# Altium project PCB_Project_invertor.PrjPcb
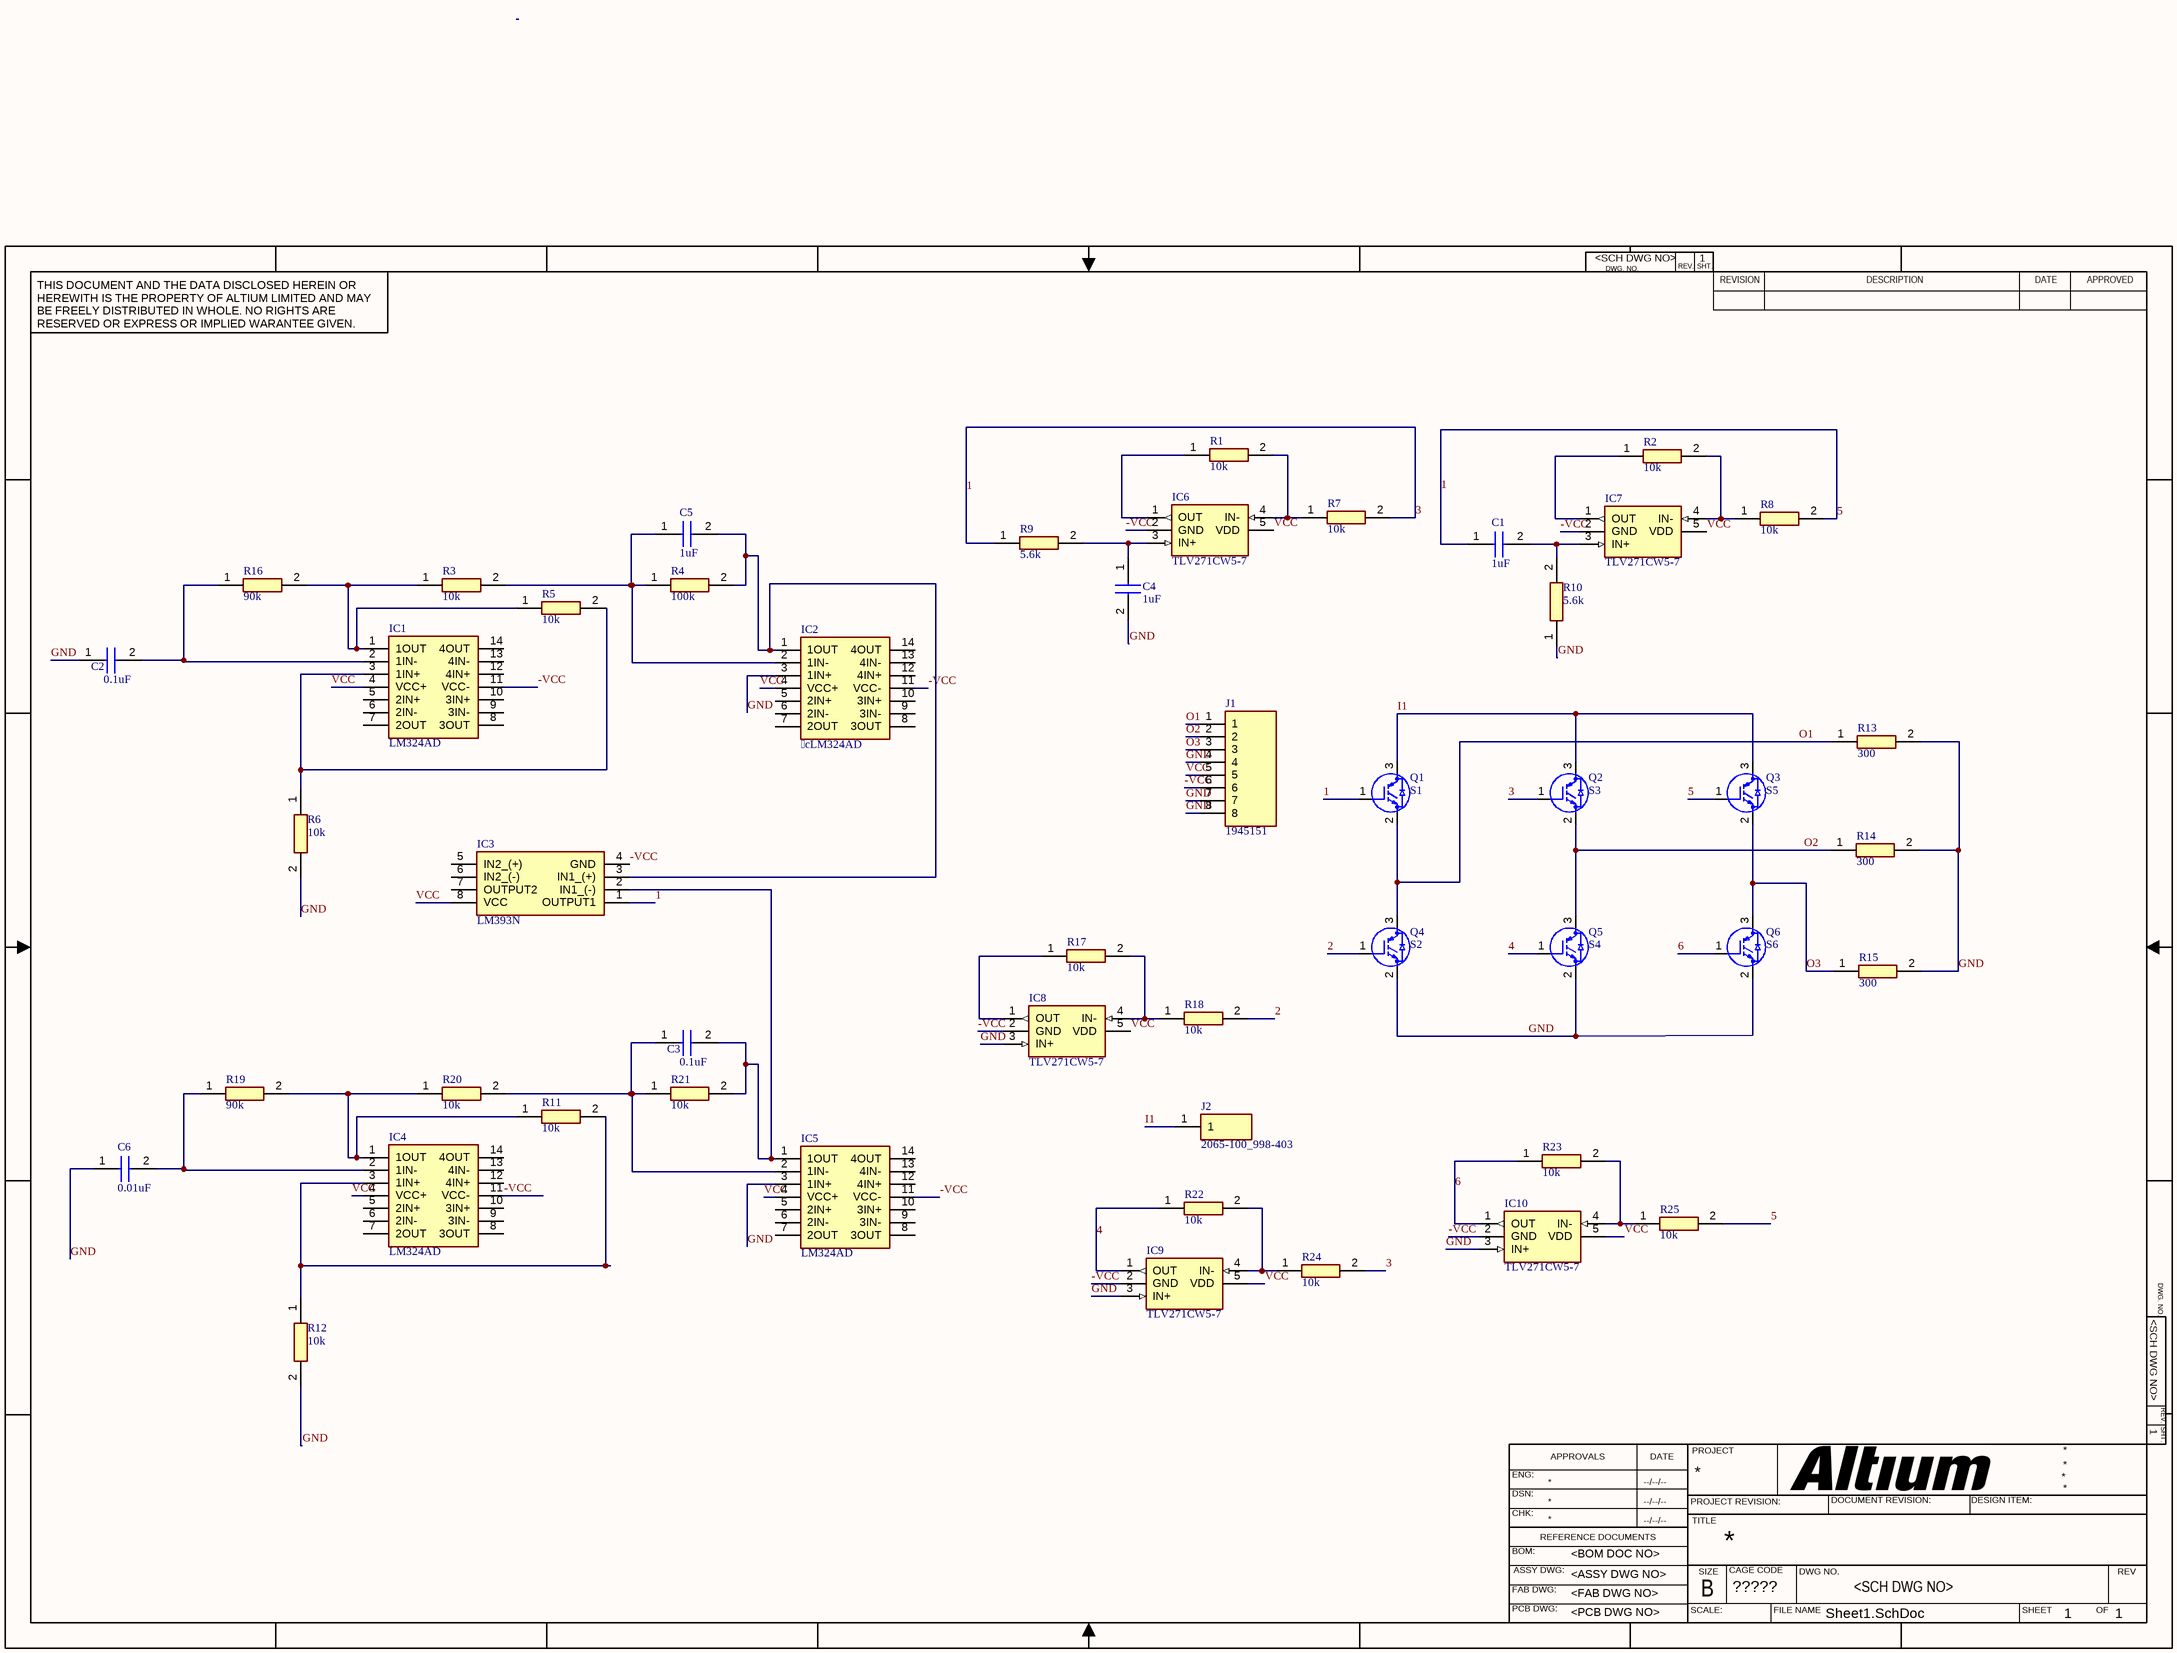
[diagram p0: Sheet1.SchDoc]
CAGE_CODE: ?????; CONTRACT_NUMBER: <CONTRACT NO>; DOC_NO_ASSY_DWG: <ASSY DWG NO>; DOC_NO_BOM: <BOM DOC NO>; DOC_NO_FAB_DWG: <FAB DWG NO>; DOC_NO_SCH_DWG: <SCH DWG NO>; PCB_2_DEC_TOL: +/-.01; PCB_3_DEC_TOL: +/-.010; PCB_ANG_TOL: +/-1/2; PCB_ASSEMBLY_NO: <PCB ASSY NO>; PCB_CHECKER: - -----; PCB_CHECKER_APP_DATE: --/--/----; PCB_DESIGNER: - -----; PCB_DESIGNER_APP_DATE: --/--/----; PCB_DWG_NO: <PCB DWG NO>; PCB_ENGINEER: - -----; PCB_ENGINEER_APP_DATE: --/--/----; PCB_PART_NUMBER: <PCB PN>; PCB_REV: A; SCH_REV: A
1 sheet, 49 parts. Net scope: global (net labels, ports and power ports of the same name join across sheets).
Board file: PCB1.PcbDoc

## Sheet Sheet1.SchDoc
size 431 x 279 mm; SheetNumber: 1; SheetTotal: 1; ENG_APP_DATE: --/--/--; DSN_APP_DATE: --/--/--; CHK_APP_DATE: --/--/--

### Parts
C1  1uF  [CAPC1005X55N]
C2  0.1uF  [CAPC1005X55N]
C3  0.1uF  [CAPC1005X55N]
C4  1uF  [CAPC1005X55N]
C5  1uF  [CAPC1005X55N]
C6  0.01uF  [C0603]
IC1  LM324AD  [SOIC127P600X175-14N]
IC2  cLM324AD  [SOIC127P600X175-14N]
IC3  LM393N  [DIP762W53P254L980H533Q8N]
IC4  LM324AD  [SOIC127P600X175-14N]
IC5  LM324AD  [SOIC127P600X175-14N]
IC6  TLV271CW5-7  [SOT95P285X130-5N]
IC7  TLV271CW5-7  [SOT95P285X130-5N]
IC8  TLV271CW5-7  [SOT95P285X130-5N]
IC9  TLV271CW5-7  [SOT95P285X130-5N]
IC10  TLV271CW5-7  [SOT95P285X130-5N]
J1  1945151  [1945151]
J2  2065-100_998-403  [2065100998403]
Q1  S1  [TO544P521X1592X2557-3P]
Q2  S3  [TO544P521X1592X2557-3P]
Q3  S5  [TO544P521X1592X2557-3P]
Q4  S2  [TO544P521X1592X2557-3P]
Q5  S4  [TO544P521X1592X2557-3P]
Q6  S6  [TO544P521X1592X2557-3P]
R1  10k  [RESC2012X60N]
R2  10k  [RESC2012X60N]
R3  10k  [RESC2012X60N]
R4  100k  [RESC2012X60N]
R5  10k  [RESC2012X60N]
R6  10k  [RESC2012X60N]
R7  10k  [RESC2012X60N]
R8  10k  [RESC2012X60N]
R9  5.6k  [RESC1005X40N]
R10  5.6k  [RESC1005X40N]
R11  10k  [RESC2012X60N]
R12  10k  [RESC2012X60N]
R13  300  [RESC1632X65N]
R14  300  [RESC1632X65N]
R15  300  [RESC1632X65N]
R16  90k  [RESC3116X65N]
R17  10k  [RESC2012X60N]
R18  10k  [RESC2012X60N]
R19  90k  [RESC3116X65N]
R20  10k  [RESC2012X60N]
R21  10k  [RESC2012X60N]
R22  10k  [RESC2012X60N]
R23  10k  [RESC2012X60N]
R24  10k  [RESC2012X60N]
R25  10k  [RESC2012X60N]

### Nets
1: C1.1 IC3.1(OUTPUT1) Q1.1(G) Q2.1(G) Q3.1(G) R7.2 R8.2 R9.1 R24.2 R25.2  [also labelled 3, 5]
2: Q4.1(G) R18.2
4: IC9.1(OUT) Q5.1(G) R22.1
6: IC10.1(OUT) Q6.1(G) R23.1
-VCC: IC1.11(VCC-) IC2.11(VCC-) IC3.4(GND) IC4.11(VCC-) IC5.11(VCC-) IC6.2(GND) IC7.2(GND) IC8.2(GND) IC9.2(GND) IC10.2(GND) J1.6
GND: C2.1 C4.2 C6.1 IC2.3(1IN+) IC5.3(1IN+) IC8.3(IN+) IC9.3(IN+) IC10.3(IN+) J1.4 J1.7 J1.8 Q4.2(E) Q5.2(E) Q6.2(E) R6.2 R10.1 R12.2 R13.2 R14.2 R15.2
I1: J2.1 Q1.3(C) Q2.3(C) Q3.3(C)
O1: J1.1 Q1.2(E) Q4.3(C) R13.1
O2: J1.2 Q2.2(E) Q5.3(C) R14.1
O3: J1.3 Q3.2(E) Q6.3(C) R15.1
VCC: IC1.4(VCC+) IC2.4(VCC+) IC3.8(VCC) IC4.4(VCC+) IC5.4(VCC+) IC6.5(VDD) IC7.5(VDD) IC8.5(VDD) IC9.5(VDD) IC10.5(VDD) J1.5
NetC1_2: C1.2 IC7.3(IN+) R10.2
NetC2_2: C2.2 IC1.2(1IN-) R16.1
NetC3_1: C3.1 IC5.2(1IN-) R20.2 R21.1
NetC3_2: C3.2 IC3.2(IN1_(-)) IC5.1(1OUT) R21.2
NetC4_1: C4.1 IC6.3(IN+) R9.2
NetC5_1: C5.1 IC2.2(1IN-) R3.2 R4.1
NetC5_2: C5.2 IC2.1(1OUT) IC3.3(IN1_(+)) R4.2
NetC6_2: C6.2 IC4.2(1IN-) R19.1
NetIC1_1: IC1.1(1OUT) R3.1 R5.1 R16.2
NetIC1_3: IC1.3(1IN+) R5.2 R6.1
NetIC4_1: IC4.1(1OUT) R11.1 R19.2 R20.1
NetIC4_3: IC4.3(1IN+) R11.2 R12.1
NetIC6_1: IC6.1(OUT) R1.1
NetIC6_4: IC6.4(IN-) R1.2 R7.1
NetIC7_1: IC7.1(OUT) R2.1
NetIC7_4: IC7.4(IN-) R2.2 R8.1
NetIC8_1: IC8.1(OUT) R17.1
NetIC8_4: IC8.4(IN-) R17.2 R18.1
NetIC9_4: IC9.4(IN-) R22.2 R24.1
NetIC10_4: IC10.4(IN-) R23.2 R25.1

Not connected (* = marked no-connect by the designer): IC1 5(2IN+) 6(2IN-) 7(2OUT) 8(3OUT) 9(3IN-) 10(3IN+) 12(4IN+) 13(4IN-) 14(4OUT); IC2 5(2IN+) 6(2IN-) 7(2OUT) 8(3OUT) 9(3IN-) 10(3IN+) 12(4IN+) 13(4IN-) 14(4OUT); IC3 5(IN2_(+)) 6(IN2_(-)) 7(OUTPUT2); IC4 5(2IN+) 6(2IN-) 7(2OUT) 8(3OUT) 9(3IN-) 10(3IN+) 12(4IN+) 13(4IN-) 14(4OUT); IC5 5(2IN+) 6(2IN-) 7(2OUT) 8(3OUT) 9(3IN-) 10(3IN+) 12(4IN+) 13(4IN-) 14(4OUT)

### Notes on the sheet
- DWG. NO.
- REV.
- SHT.
- THIS DOCUMENT AND THE DATA DISCLOSED HEREIN OR HEREWITH IS THE PROPERTY OF ALTIUM LIMITED AND MAY BE FREELY DISTRIBUTED IN WHOLE. NO RIGHTS ARE RESERVED OR EXPRESS OR IMPLIED WARANTEE GIVEN.
- REVISION
- DESCRIPTION
- DATE
- APPROVED
- ENG:
- APPROVALS
- PROJECT
- DSN:
- CHK:
- REFERENCE DOCUMENTS
- PROJECT REVISION:
- TITLE
- DOCUMENT REVISION:
- DESIGN ITEM:
- BOM:
- FAB DWG:
- PCB DWG:
- ASSY DWG:
- SCALE:
- SIZE
- B
- CAGE CODE
- FILE NAME
- DWG NO.
- SHEET
- OF
- REV

### Library data of the parts
C1 C4 C5 = JMK105BJ105KV-F: Capacitor; Manufacturer_Name: TAIYO YUDEN; Datasheet Link: https://datasheet.datasheetarchive.com/originals/distributors/Datasheets-DGA20/25674.pdf; Height: 0.55mm; Manufacturer_Part_Number: JMK105BJ105KV-F; Mouser Part Number: 963-JMK105BJ105KV-F; Mouser Price/Stock: https://www.mouser.co.uk/ProductDetail/TAIYO-YUDEN/JMK105BJ105KV-F?qs=I6KAKw0tg2yJ6Hx%2Fbib9CA%3D%3D
C2 C3 = CL05B104KP5NNNC: Capacitor; Manufacturer_Name: SAMSUNG; Datasheet Link: http://product.samsungsem.com/mlcc/CL05B104KP5NNN.do; Height: 0.55mm; Manufacturer_Part_Number: CL05B104KP5NNNC; Mouser Part Number: 187-CL05B104KP5NNNC; Mouser Price/Stock: https://www.mouser.co.uk/ProductDetail/Samsung-Electro-Mechanics/CL05B104KP5NNNC?qs=349EhDEZ59qDkVTTBSSSxw%3D%3D; Arrow Part Number: CL05B104KP5NNNC; Arrow Price/Stock: https://www.arrow.com/en/products/cl05b104kp5nnnc/samsung-electro-mechanics?region=nac
C6 = C0603C103J5REC7411: Capacitor; Manufacturer_Name: KEMET; Datasheet Link: https://content.kemet.com/datasheets/KEM_C1090_X7R_ESD.pdf; Height: 0.87mm; Manufacturer_Part_Number: C0603C103J5REC7411; Mouser Part Number: 80-C0603C103J5RE7411; Mouser Price/Stock: https://www.mouser.co.uk/ProductDetail/KEMET/C0603C103J5REC7411?qs=Mv7BduZupUg87Ut%2FUQ7ZXg%3D%3D; Arrow Part Number: C0603C103J5REC7411; Arrow Price/Stock: https://www.arrow.com/en/products/c0603c103j5rec7411/kemet-corporation?region=nac
IC1 IC2 IC4 IC5 = LM324AD: Integrated Circuit; Manufacturer_Name: Texas Instruments; Datasheet Link: http://www.ti.com/lit/ds/symlink/lm324a.pdf; Height: 1.75mm; Manufacturer_Part_Number: LM324AD; Mouser Part Number: 595-LM324AD; Mouser Price/Stock: https://www.mouser.co.uk/ProductDetail/Texas-Instruments/LM324AD?qs=KaAwwOlwapt3jpyTZJatfQ%3D%3D; Arrow Part Number: LM324AD; Arrow Price/Stock: https://www.arrow.com/en/products/lm324ad/texas-instruments?region=nac
IC3 = LM393N: Integrated Circuit; Manufacturer_Name: onsemi; Datasheet Link: http://www.onsemi.com/pub/Collateral/LM293A-D.pdf; Height: 5.33mm; Manufacturer_Part_Number: LM393N; Mouser Part Number: 512-LM393N; Mouser Price/Stock: https://www.mouser.co.uk/ProductDetail/onsemi-Fairchild/LM393N?qs=nkpohTZxueNdqcpnqJ9y4g%3D%3D; Arrow Part Number: LM393N; Arrow Price/Stock: https://www.arrow.com/en/products/lm393n/on-semiconductor
IC6-IC10 = TLV271CW5-7: Integrated Circuit; Manufacturer_Name: Diodes Incorporated; Datasheet Link: https://datasheet.datasheetarchive.com/originals/distributors/Datasheets-DGA25/1624112.pdf; Height: 1.3mm; Manufacturer_Part_Number: TLV271CW5-7; Mouser Part Number: 621-TLV271CW5-7; Mouser Price/Stock: https://www.mouser.co.uk/ProductDetail/Diodes-Incorporated/TLV271CW5-7?qs=dOK1vf2izjvah6baIk3yaA%3D%3D; Arrow Part Number: TLV271CW5-7; Arrow Price/Stock: https://www.arrow.com/en/products/tlv271cw5-7/diodes-incorporated?region=nac
J1 = 1945151: Connector; Manufacturer_Name: Phoenix Contact; Datasheet Link: http://www.phoenixcontact.com/de/produkte/1945151/pdf; Height: 9.2mm; Manufacturer_Part_Number: 1945151; Mouser Part Number: 651-1945151; Mouser Price/Stock: https://www.mouser.co.uk/ProductDetail/Phoenix-Contact/1945151?qs=BYlwlsDsB%2FoyXM%2FBwWKgUA%3D%3D; Arrow Part Number: 1945151; Arrow Price/Stock: https://www.arrow.com/en/products/1945151/phoenix-contact?region=nac
J2 = 2065-100_998-403: Connector; Manufacturer_Name: Wago; Manufacturer_Part_Number: 2065-100/998-403; Datasheet Link: https://www.wago.com/2065-100/998-403; Height: 2.7mm; Arrow Part Number: 2065-100/998-403; Arrow Price/Stock: null?region=nac
Q1-Q6 = IHW30N160R5XKSA1: Transistor IGBT; Manufacturer_Name: Infineon; Datasheet Link: https://www.infineon.com/dgdl/Infineon-IHW30N160R5-DS-v02_01-EN.pdf?fileId=5546d462677d0f460167ac8d680e1923; Height: 5.21mm; Manufacturer_Part_Number: IHW30N160R5XKSA1; Mouser Part Number: 726-IHW30N160R5XKSA1; Mouser Price/Stock: https://www.mouser.co.uk/ProductDetail/Infineon-Technologies/IHW30N160R5XKSA1?qs=l7cgNqFNU1iDDdZRXMbfcQ%3D%3D; Arrow Part Number: IHW30N160R5XKSA1; Arrow Price/Stock: https://www.arrow.com/en/products/ihw30n160r5xksa1/infineon-technologies-ag?region=nac
R1-R3 R5-R8 R11 R12 R17 R18 R20-R25 = RC0805FR-0710KL: Resistor; Manufacturer_Name: YAGEO; Datasheet Link: https://www.yageo.com/upload/media/product/productsearch/datasheet/rchip/PYu-RC_Group_51_RoHS_L_11.pdf; Height: 0.6mm; Manufacturer_Part_Number: RC0805FR-0710KL; Mouser Part Number: 603-RC0805FR-0710KL; Mouser Price/Stock: https://www.mouser.co.uk/ProductDetail/YAGEO/RC0805FR-0710KL?qs=7bY8808IzHq6vrU3BeiiYw%3D%3D; Arrow Part Number: RC0805FR-0710KL; Arrow Price/Stock: https://www.arrow.com/en/products/rc0805fr-0710kl/yageo?region=nac
R4 = RC0805FR-07100KL: Resistor; Manufacturer_Name: KEMET; Datasheet Link: http://www.yageo.com/documents/recent/PYu-RC_Group_51_RoHS_L_10.pdf; Height: 0.6mm; Manufacturer_Part_Number: RC0805FR-07100KL; Mouser Part Number: 603-RC0805FR-07100KL; Mouser Price/Stock: https://www.mouser.co.uk/ProductDetail/YAGEO/RC0805FR-07100KL?qs=8Y8p%252BasKcI7rEWn6FcVdAA%3D%3D; Arrow Part Number: RC0805FR-07100KL; Arrow Price/Stock: https://www.arrow.com/en/products/rc0805fr-07100kl/yageo?region=nac
R9 R10 = RC0402FR-075K6L: Resistor; Manufacturer_Name: KEMET; Datasheet Link: http://www.yageo.com/documents/recent/PYu-RC0402_51_RoHS_L_6_r.pdf; Height: 0.4mm; Manufacturer_Part_Number: RC0402FR-075K6L; Mouser Part Number: 603-RC0402FR-075K6L; Mouser Price/Stock: https://www.mouser.co.uk/ProductDetail/YAGEO/RC0402FR-075K6L?qs=Is6ZsIPfHkZGbvQHE6fDOQ%3D%3D; Arrow Part Number: RC0402FR-075K6L; Arrow Price/Stock: https://www.arrow.com/en/products/rc0402fr-075k6l/yageo?region=nac
R13-R15 = LTR18EZPJ301: Resistor; Manufacturer_Name: ROHM Semiconductor; Datasheet Link: https://componentsearchengine.com/Datasheets/1/LTR18EZPJ301.pdf; Height: 0.65mm; Manufacturer_Part_Number: LTR18EZPJ301; Mouser Part Number: 755-LTR18EZPJ301; Mouser Price/Stock: https://www.mouser.co.uk/ProductDetail/ROHM-Semiconductor/LTR18EZPJ301?qs=DyUWGjl%252BcVuuqATaEQmgHQ%3D%3D
R16 R19 = RT1206DRE0790KL: Resistor; Manufacturer_Name: KEMET; Datasheet Link: https://www.yageo.com/en/ProductSearch/PartNumberSearch?part_number=RT1206DRE0790KL; Height: 0.65mm; Manufacturer_Part_Number: RT1206DRE0790KL; Mouser Part Number: 603-RT1206DRE0790KL; Mouser Price/Stock: https://www.mouser.co.uk/ProductDetail/Yageo/RT1206DRE0790KL?qs=NgbZBzc1CyEoLHe57MF17w%3D%3D